# Altium project SENSEI_Base-Board.PrjPcb (part 3 of 3)
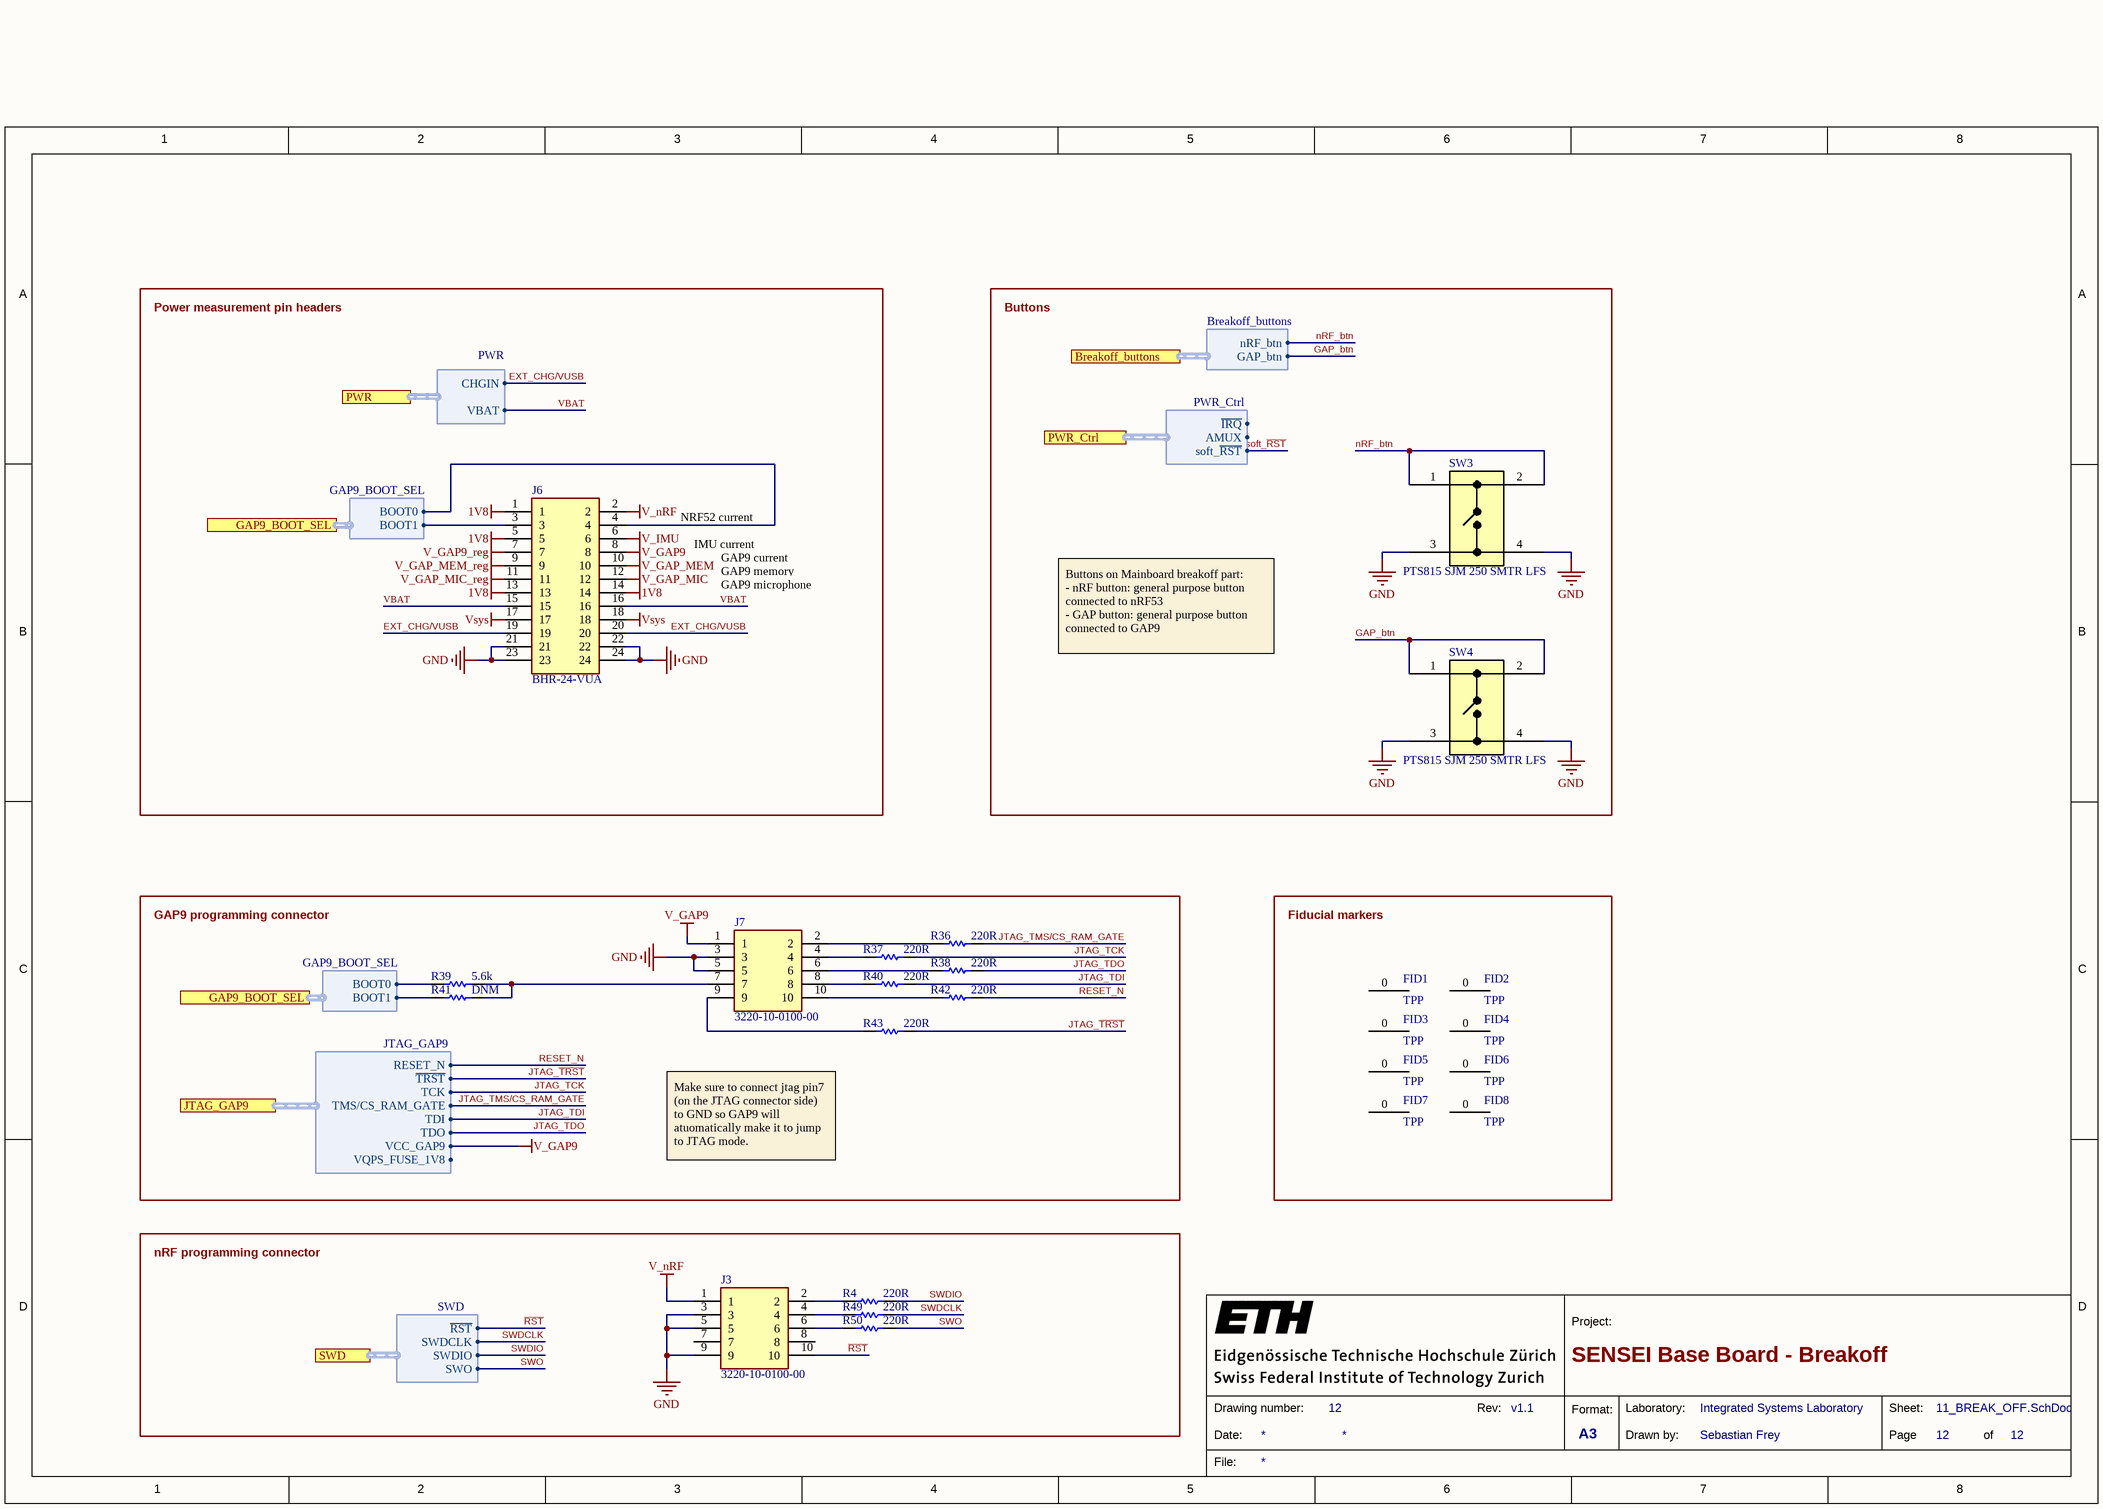
[diagram p12: 11_BREAK_OFF.SchDoc]

## Nets that join several sheets
1V8: 00_POWER (13 pins), 04_GAP_GPIO (10 pins), 10_CONNECTOR (J2.6 J2.7 J5.1), 11_BREAK_OFF (J6.1 J6.5 J6.13 J6.14)
GND: 00_POWER (46 pins), 01_GAP_POWER (33 pins), 02_GAP_JTAG_XTALs (C3.2 C4.2 Y2.2), 03_GAP_MEM (20 pins), 04_GAP_GPIO (10 pins), 05_GAP_MIC (C90.2 MIC1.3 R17.1 R23.1), 06_nRF_POWER_SWD_RF (39 pins), 07_nRF_GPIO (C81.2 IC2.B1 IC2.C1 IC2.D1), 08_nRF_RAM (C82.2 C83.2 U17.C2), 09_SHARED_PERIPHERAL (12 pins), 10_CONNECTOR (14 pins), 11_BREAK_OFF (13 pins)
V0p65_CSI2: 00_POWER (C96.1 U20.A1), 01_GAP_POWER (C88.1 C89.1 GAP1.A4)
V1p8_CSI2_SW: 00_POWER (C85.1 U18.A1), 01_GAP_POWER (C86.1 C87.1 GAP1.C7)
V_GAP9: 00_POWER (C84.1 R5.2 U18.A2), 01_GAP_POWER (18 pins), 02_GAP_JTAG_XTALs (R22.2), 04_GAP_GPIO (R14.2 R15.2), 10_CONNECTOR (J4.13), 11_BREAK_OFF (J6.8 J7.1)
V_GAP9_reg: 00_POWER (C21.1 R5.1 U6.A1), 11_BREAK_OFF (J6.7)
V_GAP_MEM: 00_POWER (R8.2), 03_GAP_MEM (19 pins), 11_BREAK_OFF (J6.10)
V_GAP_MEM_reg: 00_POWER (C39.1 R8.1 U7.A1), 11_BREAK_OFF (J6.9)
V_GAP_MIC: 00_POWER (R10.2), 05_GAP_MIC (C90.1 MIC1.7 R21.2), 11_BREAK_OFF (J6.12)
V_GAP_MIC_reg: 00_POWER (C48.1 R10.1 U8.A1), 11_BREAK_OFF (J6.11)
V_IMU: 00_POWER (R3.2), 09_SHARED_PERIPHERAL (6 pins), 11_BREAK_OFF (J6.6)
V_nRF: 00_POWER (6 pins), 06_nRF_POWER_SWD_RF (19 pins), 07_nRF_GPIO (6 pins), 11_BREAK_OFF (J3.1 J6.2)
V_nRF_RAM: 00_POWER (C19.1 U4.A1), 08_nRF_RAM (C82.1 C83.1 R31.2 U17.A4)
VA0: 00_POWER (C45.1 U3.B5), 10_CONNECTOR (J2.41)
VA1: 00_POWER (C93.1 U3.A5), 10_CONNECTOR (J2.11)
VD0: 00_POWER (C41.1 U3.B6 U3.C6), 10_CONNECTOR (J2.42)
VD1: 00_POWER (C42.1 U3.C4), 10_CONNECTOR (J2.9)
VD2: 00_POWER (C43.1 U3.D4), 10_CONNECTOR (J2.10)
VRAR_OUT: 00_POWER (C95.1 U20.A2), 01_GAP_POWER (16 pins)
Vsys: 00_POWER (10 pins), 09_SHARED_PERIPHERAL (C61.1 C92.1 D1.1 U15.A2), 10_CONNECTOR (J2.3 J2.4), 11_BREAK_OFF (J6.17 J6.18)
ADS_A_DR: 04_GAP_GPIO (U9.1), 07_nRF_GPIO (U5.G11), 10_CONNECTOR (J2.22)
ADS_B_DR: 04_GAP_GPIO (U9.12), 07_nRF_GPIO (U5.H12), 10_CONNECTOR (J2.23)
CS_nRF_GAP: 04_GAP_GPIO (GAP1.H1), 07_nRF_GPIO (U5.K3)
CSI_CLK_N: 03_GAP_MEM (GAP1.E7), 10_CONNECTOR (J4.17)
CSI_CLK_P: 03_GAP_MEM (GAP1.D7), 10_CONNECTOR (J4.19)
CSI_D0_N: 03_GAP_MEM (GAP1.C6), 10_CONNECTOR (J4.23)
CSI_D0_P: 03_GAP_MEM (GAP1.B6), 10_CONNECTOR (J4.25)
EXT_CHG/VUSB: 00_POWER (C13.1 U3.E1), 06_nRF_POWER_SWD_RF (R25.2), 10_CONNECTOR (D4.1 J2.47 J2.48), 11_BREAK_OFF (J6.19 J6.20)
EXT_RX_SPI: 04_GAP_GPIO (GAP1.H2), 07_nRF_GPIO (U5.J3)
GAP9_pwr_sel: 00_POWER (U6.B2), 07_nRF_GPIO (U5.C10)
GAP_btn: 04_GAP_GPIO (GAP1.K7), 11_BREAK_OFF (SW4.1 SW4.2)
GAP_CSI2_pwr_sel: 00_POWER (R32.2 U18.B2 U20.B2), 04_GAP_GPIO (GAP1.H4)
GAP_CTRL: 04_GAP_GPIO (GAP1.H3), 07_nRF_GPIO (U5.L3)
GAP_GPIO46: 04_GAP_GPIO (GAP1.H5), 10_CONNECTOR (J4.29)
GAP_GPIO47: 04_GAP_GPIO (GAP1.J5), 10_CONNECTOR (J4.31)
GAP_GPIO48: 04_GAP_GPIO (GAP1.G6), 10_CONNECTOR (J4.37 J5.6)
GAP_GPIO49: 04_GAP_GPIO (GAP1.G7), 10_CONNECTOR (J4.39)
GAP_GPIO50: 04_GAP_GPIO (GAP1.K5), 10_CONNECTOR (J4.33 J5.4)
GAP_GPIO51: 04_GAP_GPIO (GAP1.H6), 10_CONNECTOR (J4.35)
GAP_MEM_pwr_sel: 00_POWER (R11.2 U7.B2), 04_GAP_GPIO (GAP1.B1)
GAP_MIC_pwr_sel: 00_POWER (R13.2 U8.B2), 04_GAP_GPIO (GAP1.D2)
I2C_A_SCL: 00_POWER (U3.B4), 04_GAP_GPIO (U11.1), 07_nRF_GPIO (R26.2 U5.J11), 09_SHARED_PERIPHERAL (U15.C1 U21.13), 10_CONNECTOR (J2.36)
I2C_A_SDA: 00_POWER (U3.A3), 04_GAP_GPIO (U11.12), 07_nRF_GPIO (R27.2 U5.K12), 09_SHARED_PERIPHERAL (U15.B1 U21.14), 10_CONNECTOR (J2.35)
I2C_B_SCL: 04_GAP_GPIO (U11.9), 07_nRF_GPIO (R28.2 U5.E4), 10_CONNECTOR (J2.30 J5.3)
I2C_B_SDA: 04_GAP_GPIO (U11.4), 07_nRF_GPIO (R29.2 U5.K2), 10_CONNECTOR (J2.32 J5.5)
I2C_GAP_SEL: 04_GAP_GPIO (U11.6 U11.7 U11.14 U11.15), 07_nRF_GPIO (U5.H10)
IMU_INT1: 07_nRF_GPIO (U5.H3), 09_SHARED_PERIPHERAL (U21.4)
JTAG_~{TRST}: 02_GAP_JTAG_XTALs (GAP1.F2), 10_CONNECTOR (J4.3), 11_BREAK_OFF (R43.2)
JTAG_TCK: 02_GAP_JTAG_XTALs (GAP1.G4), 10_CONNECTOR (J4.5), 11_BREAK_OFF (R37.2)
JTAG_TDI: 02_GAP_JTAG_XTALs (GAP1.E2), 10_CONNECTOR (J4.9), 11_BREAK_OFF (R40.2)
JTAG_TDO: 02_GAP_JTAG_XTALs (GAP1.F3), 10_CONNECTOR (J4.11), 11_BREAK_OFF (R38.2)
JTAG_TMS/CS_RAM_GATE: 02_GAP_JTAG_XTALs (GAP1.D1), 03_GAP_MEM (R12.2 U16.2), 10_CONNECTOR (J4.7), 11_BREAK_OFF (R36.2)
LED_EN: 07_nRF_GPIO (U5.K4), 09_SHARED_PERIPHERAL (U15.A1)
MIC_CLK: 04_GAP_GPIO (GAP1.J6), 05_GAP_MIC (MIC1.6 R17.2), 10_CONNECTOR (J4.36)
MIC_DATA: 04_GAP_GPIO (GAP1.K6), 05_GAP_MIC (MIC1.1), 10_CONNECTOR (J4.34)
MIC_THSEL: 04_GAP_GPIO (GAP1.H7), 05_GAP_MIC (MIC1.5), 10_CONNECTOR (J4.38)
MIC_WAKE: 04_GAP_GPIO (GAP1.C2), 05_GAP_MIC (MIC1.4), 10_CONNECTOR (J4.40)
MSP_CS: 07_nRF_GPIO (U5.C7), 10_CONNECTOR (J2.12)
MSP_DR1: 07_nRF_GPIO (U5.C8), 10_CONNECTOR (J2.13)
MSP_DR2: 07_nRF_GPIO (U5.H1), 10_CONNECTOR (J2.21)
NetD2_1: 09_SHARED_PERIPHERAL (D2.1 R20.1), 10_CONNECTOR (J4.16)
NetD3_1: 09_SHARED_PERIPHERAL (D3.1 R19.1), 10_CONNECTOR (J4.18)
nRF_btn: 07_nRF_GPIO (U5.L1), 11_BREAK_OFF (SW3.1 SW3.2)
nRF_P0.04: 07_nRF_GPIO (U5.G10), 10_CONNECTOR (J4.20)
nRF_P0.05: 07_nRF_GPIO (U5.F10), 10_CONNECTOR (J4.22)
nRF_P0.07/AMUX: 00_POWER (U3.C1), 07_nRF_GPIO (U5.J10), 10_CONNECTOR (J4.26)
nRF_P0.12_GAP_GPIO64: 04_GAP_GPIO (U10.4), 07_nRF_GPIO (U5.J6), 10_CONNECTOR (J4.12 J5.10)
nRF_P0.31: 07_nRF_GPIO (U5.C5), 10_CONNECTOR (J4.2 J5.8)
nRF_P1.00_GAP_GPIO60: 04_GAP_GPIO (U9.4), 07_nRF_GPIO (U5.D10), 10_CONNECTOR (J4.4)
nRF_P1.01_GAP_GPIO61: 04_GAP_GPIO (U10.1), 07_nRF_GPIO (U5.E10), 10_CONNECTOR (J4.6)
nRF_P1.09_GAP_GPIO62: 04_GAP_GPIO (U10.12), 07_nRF_GPIO (U5.H2), 10_CONNECTOR (J4.8)
nRF_P1.11_GAP_GPIO63: 04_GAP_GPIO (U10.9), 07_nRF_GPIO (U5.C6), 10_CONNECTOR (J4.10)
nRF_QSPI_CLK: 07_nRF_GPIO (U5.L7), 08_nRF_RAM (U17.B3), 10_CONNECTOR (J2.20)
nRF_QSPI_CS_CONN: 07_nRF_GPIO (IC2.C2), 10_CONNECTOR (J2.14)
nRF_QSPI_CS_RAM: 07_nRF_GPIO (IC2.B2), 08_nRF_RAM (R31.1 U17.A3)
nRF_QSPI_IO0: 07_nRF_GPIO (U5.K10), 08_nRF_RAM (U17.A2), 10_CONNECTOR (J2.19)
nRF_QSPI_IO1: 07_nRF_GPIO (U5.K9), 08_nRF_RAM (U17.C3), 10_CONNECTOR (J2.17)
nRF_QSPI_IO2: 07_nRF_GPIO (U5.L9), 08_nRF_RAM (U17.B2), 10_CONNECTOR (J2.16)
nRF_QSPI_IO3: 07_nRF_GPIO (U5.K8), 08_nRF_RAM (U17.B4), 10_CONNECTOR (J2.15)
nRF_RAM_pwr_sel: 00_POWER (U4.B2), 07_nRF_GPIO (U5.C9)
PMIC_~{IRQ}: 00_POWER (R6.1 U3.B2), 07_nRF_GPIO (U5.J4)
~{RST}: 06_nRF_POWER_SWD_RF (R24.2 U5.G2), 10_CONNECTOR (J2.5), 11_BREAK_OFF (J3.10)
RESET_N: 02_GAP_JTAG_XTALs (GAP1.D4 R22.1), 10_CONNECTOR (J4.1), 11_BREAK_OFF (R42.2)
SHARED_GPIOs_SEL: 04_GAP_GPIO (8 pins), 07_nRF_GPIO (U5.E3)
soft_~{RST}: 00_POWER (IC3.A1), 07_nRF_GPIO (U5.J2)
SPI_A_CLK: 04_GAP_GPIO (U12.9), 07_nRF_GPIO (U5.L12), 10_CONNECTOR (R44.2)
SPI_A_CS: 04_GAP_GPIO (U12.4), 07_nRF_GPIO (R30.2 U5.J7), 10_CONNECTOR (J2.28)
SPI_A_MISO: 04_GAP_GPIO (U12.12), 07_nRF_GPIO (U5.J8), 10_CONNECTOR (R35.2)
SPI_A_MOSI: 04_GAP_GPIO (U12.1), 07_nRF_GPIO (U5.J9), 10_CONNECTOR (R45.2)
SPI_B_CLK: 04_GAP_GPIO (U13.9), 07_nRF_GPIO (U5.G3), 10_CONNECTOR (J5.2 R46.2)
SPI_B_CLK_GAP: 04_GAP_GPIO (GAP1.D6 R14.1 U13.8), 11_BREAK_OFF (J6.4 R39.1)
SPI_B_CS: 04_GAP_GPIO (U13.4), 07_nRF_GPIO (U5.F3), 10_CONNECTOR (J2.24 J5.7)
SPI_B_MISO: 04_GAP_GPIO (U13.12), 07_nRF_GPIO (U5.E2), 10_CONNECTOR (J5.11 R48.2)
SPI_B_MISO_GAP: 04_GAP_GPIO (GAP1.D5 R15.1 U13.13), 11_BREAK_OFF (J6.3 R41.1)
SPI_B_MOSI: 04_GAP_GPIO (U13.1), 07_nRF_GPIO (U5.C4), 10_CONNECTOR (J5.9 R47.1)
SPI_GAP_SEL: 04_GAP_GPIO (8 pins), 07_nRF_GPIO (U5.K5)
SWDCLK: 06_nRF_POWER_SWD_RF (U5.F2), 10_CONNECTOR (J2.45), 11_BREAK_OFF (R49.2)
SWDIO: 06_nRF_POWER_SWD_RF (U5.F1), 10_CONNECTOR (J2.46), 11_BREAK_OFF (R4#2.2)
SWO: 07_nRF_GPIO (R30.1), 10_CONNECTOR (J2.44), 11_BREAK_OFF (R50.2)
USB_N: 06_nRF_POWER_SWD_RF (U5.A11), 10_CONNECTOR (U19.C2)
USB_P: 06_nRF_POWER_SWD_RF (U5.A12), 10_CONNECTOR (U19.C1)
VBAT: 00_POWER (C14.1 U3.E3), 10_CONNECTOR (J2.1 J2.2 J8.1), 11_BREAK_OFF (J6.15 J6.16)
VQPS_FUSE_1V8: 01_GAP_POWER (GAP1.C9), 10_CONNECTOR (J4.14)

## Assembly variants
Fabrication: not fitted C68 E2 FID1 FID2 FID3 FID4 FID5 FID6 FID7 FID8 J6 R16 R18 R21 R30 R41
NoBreakOff: not fitted C68 E2 FID1 FID2 FID3 FID4 FID5 FID6 FID7 FID8 J6 J7 R16 R18 R21 R30 R36 R37 R38 R39 R40 R41 R42 R43 SW3 SW4